# EAGLE board front-panel-test (EAGLE 5.11)
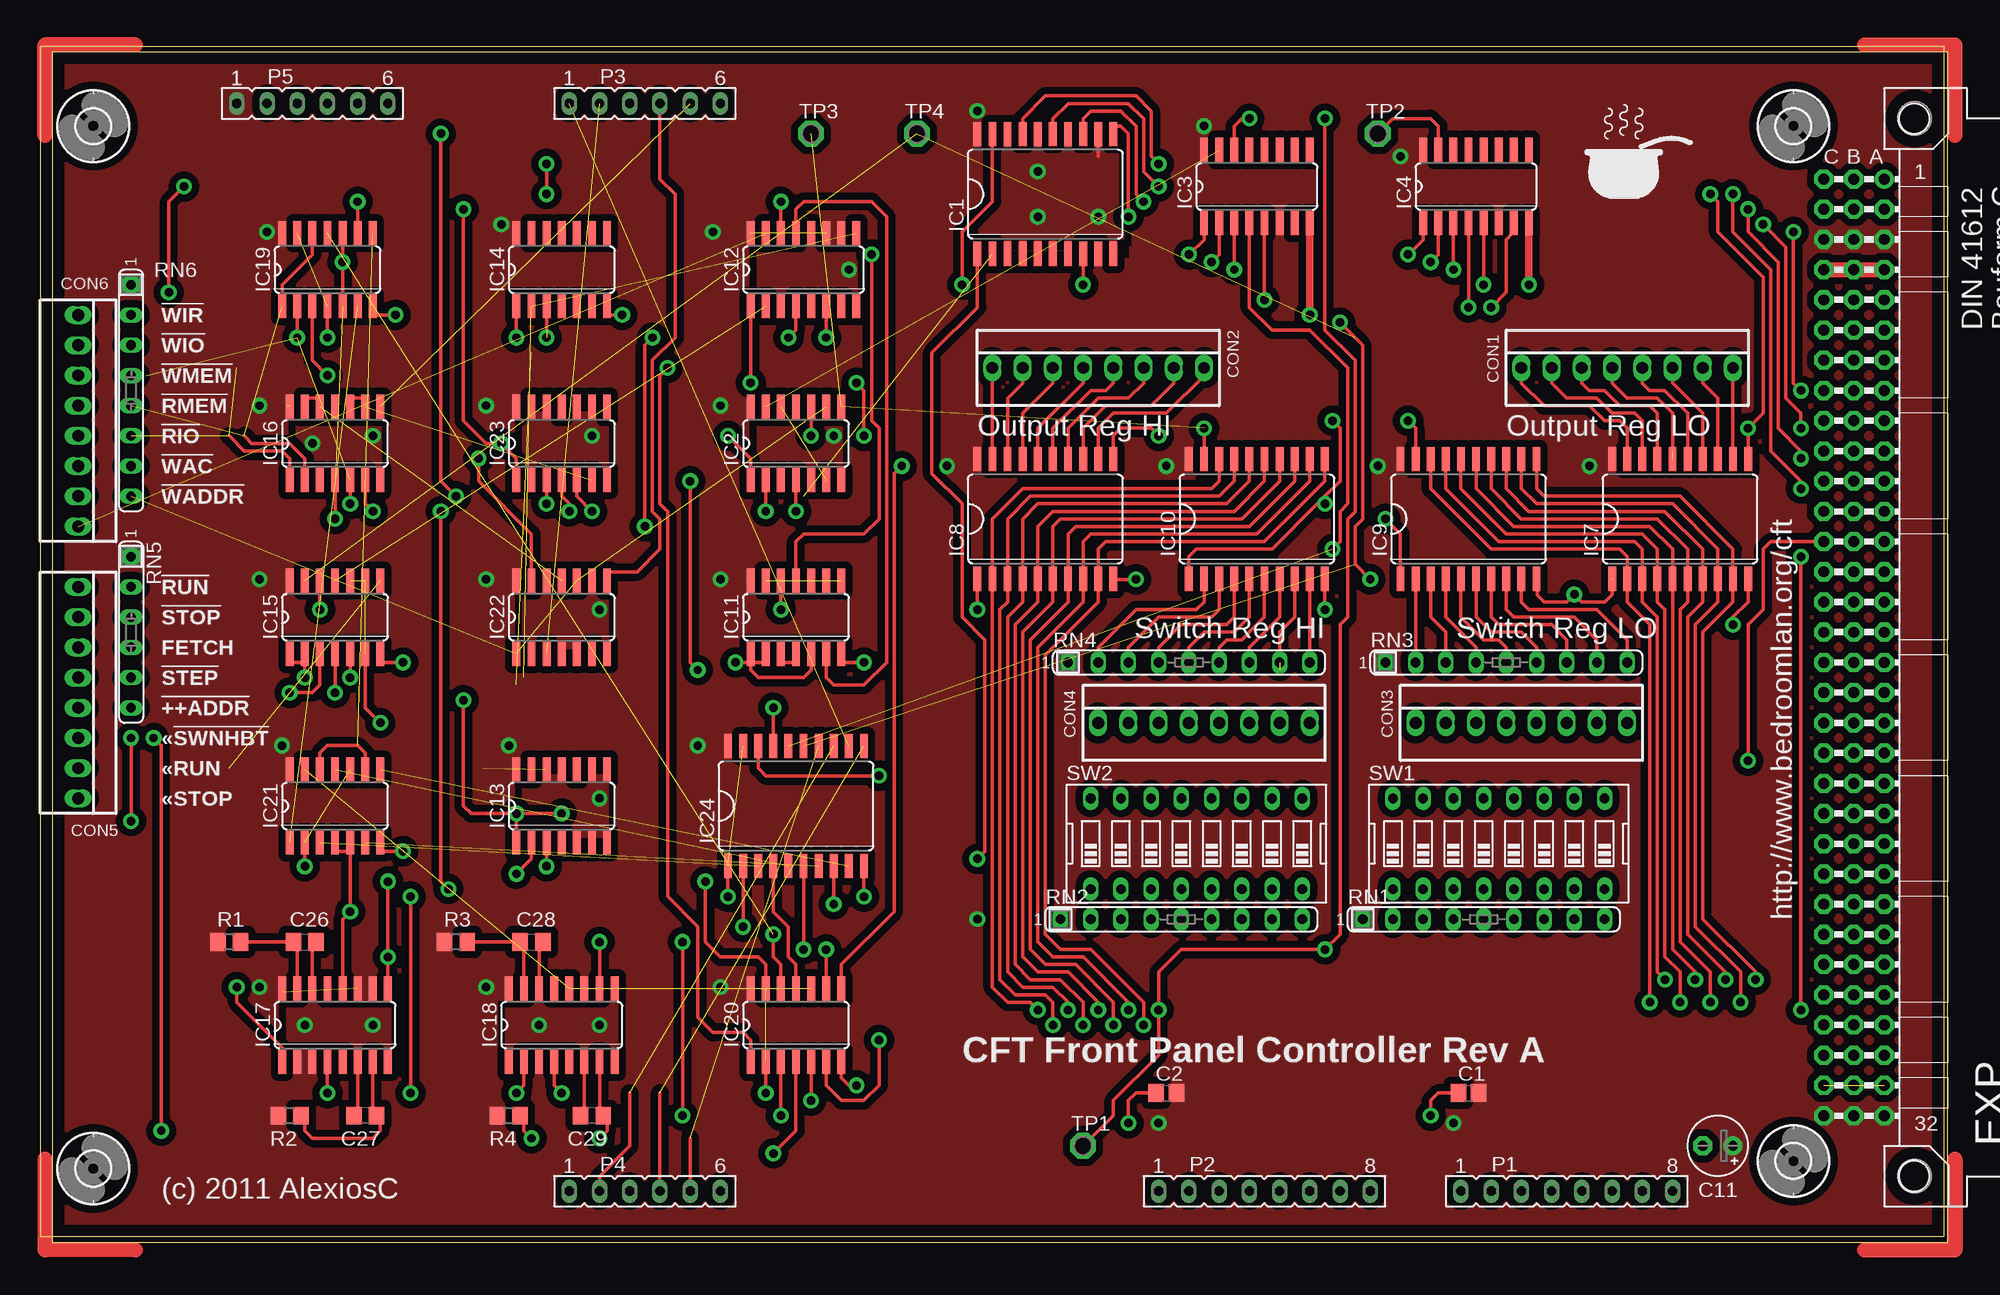
[diagram p4: board, top side]
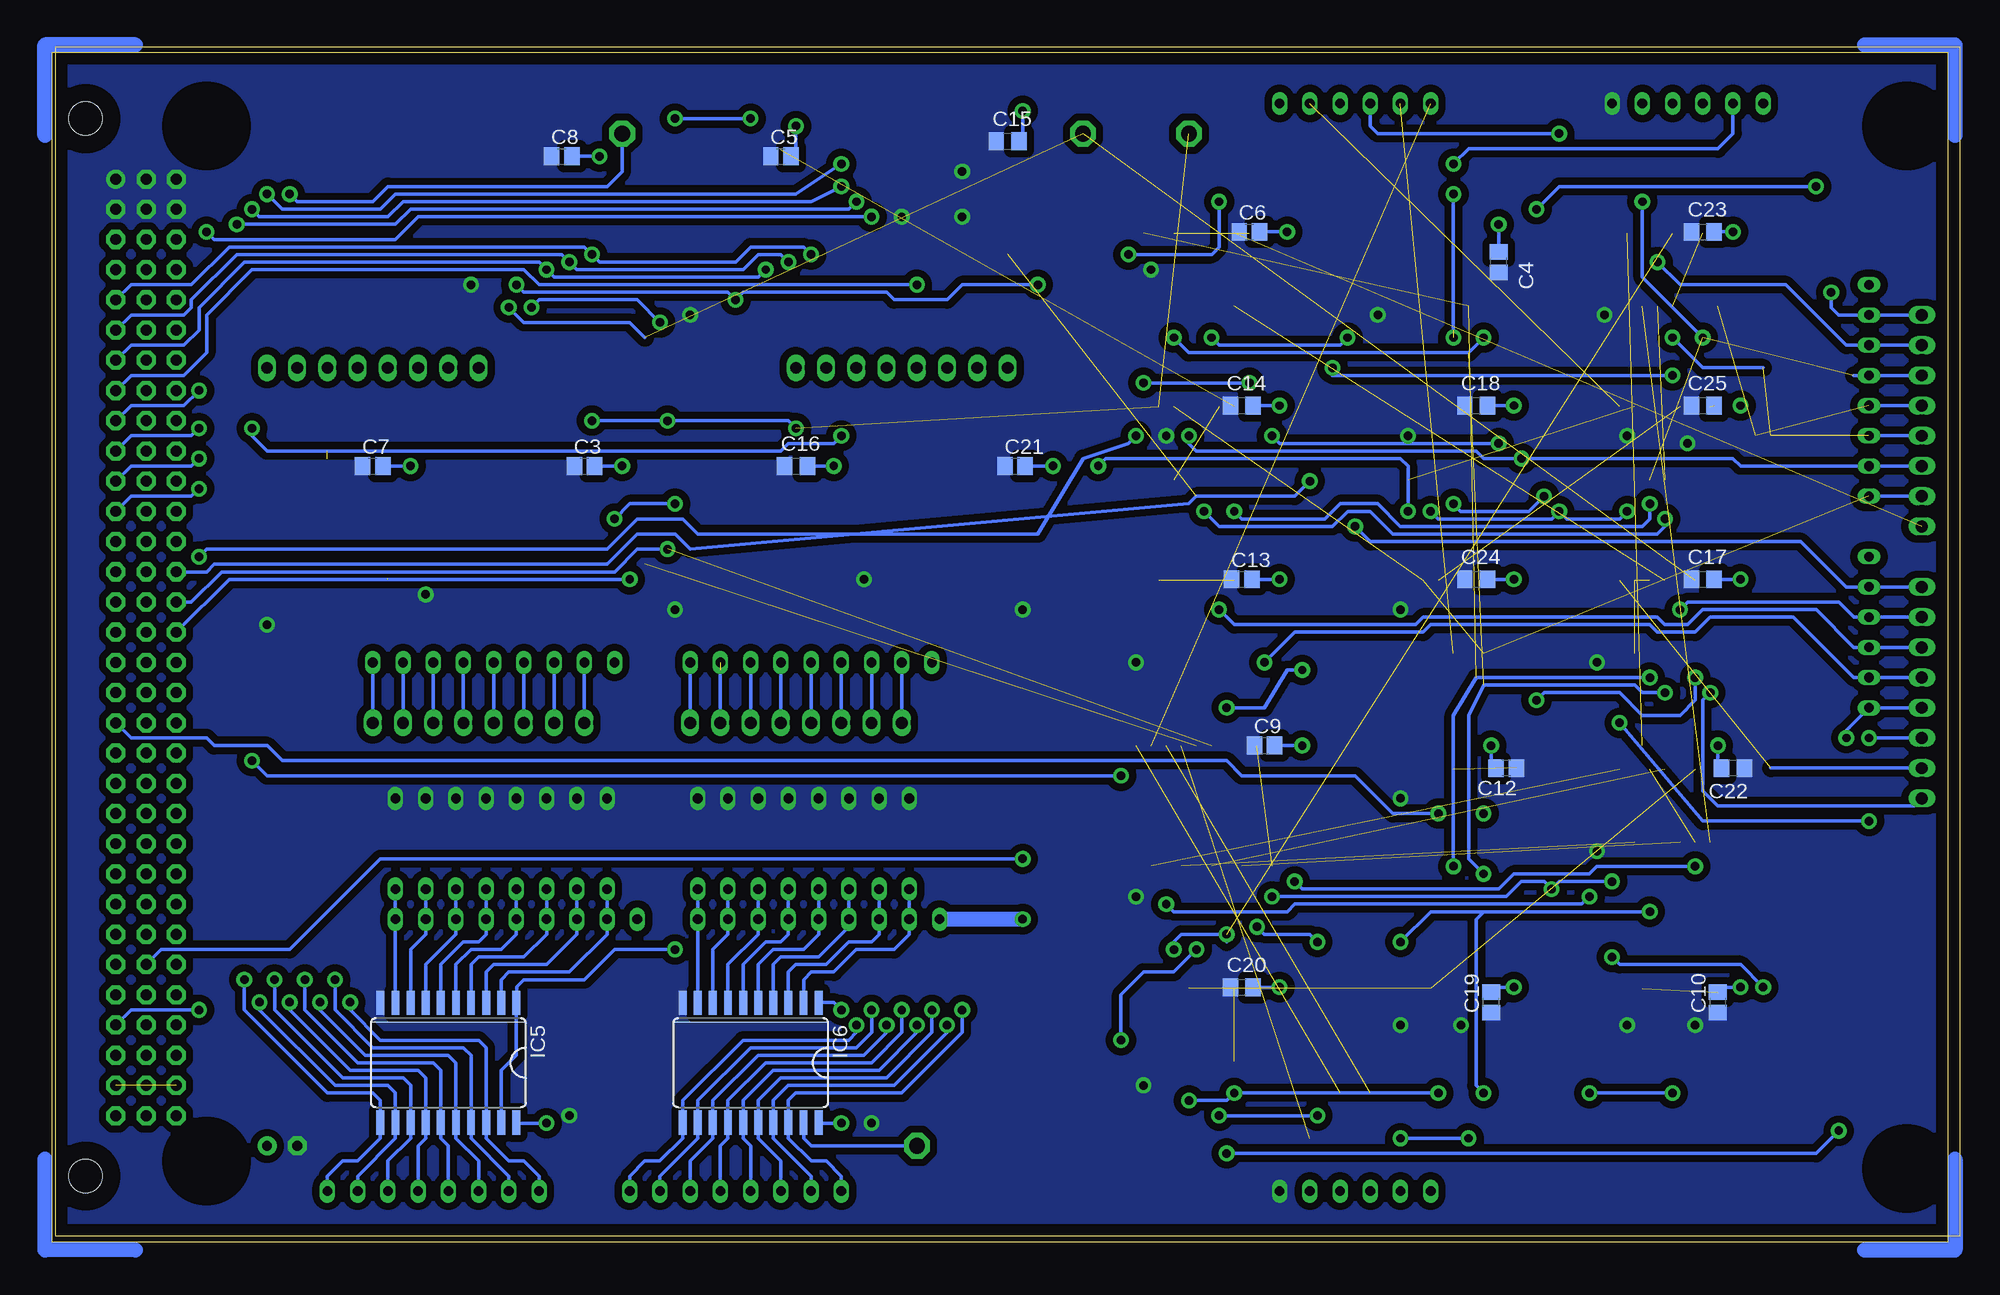
[diagram p5: board, bottom side, seen from below]

Size 160 x 100 mm. Coordinates in mm from the lower left corner, seen from the top.
Outline: 0,0 160,0 160,100 0,100 0,0
Copper layers (1*16): Top 0.035mm / dielectric 1.5mm / Bottom 0.035mm
Design rules "cft-olimex-10mil-small-pads-tented-vias": minimum track width 10mil, minimum drill 24mil, track to track 10mil, track to pad 10mil, pad to pad 10mil, via to via 10mil, smd to smd 10mil, copper to edge 40mil, drill to drill 10mil, minimum pad ring 10mil, minimum via ring 12mil, stop-mask expansion 4mil, vias tented up to drill 30mil, thermal gap 10mil
Net classes: 0 default: width 0.305 mm, clearance 0.254 mm; 1 Power: width 0.635 mm, clearance 0.254 mm; 2 12V: width 0.635 mm, clearance 0.635 mm

## Footprints (pad centres in the part's own frame; a part is rotated, then mirrored left to right if it is on the bottom)
C0805 = smd 1.3 x 1.5: 1 -0.85,0; 2 0.85,0
E2,5-5 = drill 0.813 pad 1.6 round: + -1.27,0 | drill 0.813 pad 1.6 octagon: - 1.27,0
C0805' = smd 1.3 x 1.5: 1 -0.95,0; 2 0.95,0
22-23-2081 = drill 1 long: 1 -8.89,0; 2 -6.35,0; 3 -3.81,0; 4 -1.27,0; 5 1.27,0; 6 3.81,0; 7 6.35,0; 8 8.89,0
VG96K = drill 0.914 pad 1.6 round: A1 154.94,39.37 | drill 0.914 pad 1.6 octagon: A2 154.94,36.83; A3 154.94,34.29; A4 154.94,31.75; A5 154.94,29.21; A6 154.94,26.67; A7 154.94,24.13; A8 154.94,21.59; A9 154.94,19.05; A10 154.94,16.51; A11 154.94,13.97; A12 154.94,11.43; A13 154.94,8.89; A14 154.94,6.35; A15 154.94,3.81; A16 154.94,1.27; A17 154.94,-1.27; A18 154.94,-3.81; A19 154.94,-6.35; A20 154.94,-8.89; A21 154.94,-11.43; A22 154.94,-13.97; A23 154.94,-16.51; A24 154.94,-19.05; A25 154.94,-21.59; A26 154.94,-24.13; A27 154.94,-26.67; A28 154.94,-29.21; A29 154.94,-31.75; A30 154.94,-34.29; A31 154.94,-36.83; A32 154.94,-39.37; B1 152.4,39.37; B2 152.4,36.83; B3 152.4,34.29; B4 152.4,31.75; B5 152.4,29.21; B6 152.4,26.67; B7 152.4,24.13; B8 152.4,21.59; B9 152.4,19.05; B10 152.4,16.51; B11 152.4,13.97; B12 152.4,11.43; B13 152.4,8.89; B14 152.4,6.35; B15 152.4,3.81; B16 152.4,1.27; B17 152.4,-1.27; B18 152.4,-3.81; B19 152.4,-6.35; B20 152.4,-8.89; B21 152.4,-11.43; B22 152.4,-13.97; B23 152.4,-16.51; B24 152.4,-19.05; B25 152.4,-21.59; B26 152.4,-24.13; B27 152.4,-26.67; B28 152.4,-29.21; B29 152.4,-31.75; B30 152.4,-34.29; B31 152.4,-36.83; B32 152.4,-39.37; C1 149.86,39.37; C2 149.86,36.83; C3 149.86,34.29; C4 149.86,31.75; C5 149.86,29.21; C6 149.86,26.67; C7 149.86,24.13; C8 149.86,21.59; C9 149.86,19.05; C10 149.86,16.51; C11 149.86,13.97; C12 149.86,11.43; C13 149.86,8.89; C14 149.86,6.35; C15 149.86,3.81; C16 149.86,1.27; C17 149.86,-1.27; C18 149.86,-3.81; C19 149.86,-6.35; C20 149.86,-8.89; C21 149.86,-11.43; C22 149.86,-13.97; C23 149.86,-16.51; C24 149.86,-19.05; C25 149.86,-21.59; C26 149.86,-24.13; C27 149.86,-26.67; C28 149.86,-29.21; C29 149.86,-31.75; C30 149.86,-34.29; C31 149.86,-36.83; C32 149.86,-39.37 | hole 2.794: 157.48,44.45; 157.48,-44.45
SO20W = smd 0.66 x 2.032: 1 -5.715,-5.029; 2 -4.445,-5.029; 3 -3.175,-5.029; 4 -1.905,-5.029; 5 -0.635,-5.029; 6 0.635,-5.029; 7 1.905,-5.029; 8 3.175,-5.029; 9 4.445,-5.029; 10 5.715,-5.029; 11 5.715,5.029; 12 4.445,5.029; 13 3.175,5.029; 14 1.905,5.029; 15 0.635,5.029; 16 -0.635,5.029; 17 -1.905,5.029; 18 -3.175,5.029; 19 -4.445,5.029; 20 -5.715,5.029
SO14 = smd 0.66 x 2.032: 1 -3.81,-3.073; 2 -2.54,-3.073; 3 -1.27,-3.073; 4 0,-3.073; 5 1.27,-3.073; 6 2.54,-3.073; 7 3.81,-3.073; 8 3.81,3.073; 9 2.54,3.073; 10 1.27,3.073; 11 0,3.073; 12 -1.27,3.073; 13 -2.54,3.073; 14 -3.81,3.073
SO16 = smd 0.66 x 2.032: 1 -4.445,-3.073; 2 -3.175,-3.073; 3 -1.905,-3.073; 4 -0.635,-3.073; 5 0.635,-3.073; 6 1.905,-3.073; 7 3.175,-3.073; 8 4.445,-3.073; 9 4.445,3.073; 10 3.175,3.073; 11 1.905,3.073; 12 0.635,3.073; 13 -0.635,3.073; 14 -1.905,3.073; 15 -3.175,3.073; 16 -4.445,3.073
FE08 = drill 0.813 long: 1 -8.89,0; 2 -6.35,0; 3 -3.81,0; 4 -1.27,0; 5 1.27,0; 6 3.81,0; 7 6.35,0; 8 8.89,0
FE06 = drill 0.813 long: 1 -6.35,0; 2 -3.81,0; 3 -1.27,0; 4 1.27,0; 5 3.81,0; 6 6.35,0
R0805 = smd 1.3 x 1.5: 1 -0.95,0; 2 0.95,0
SIL9 = drill 0.813 long: 1 -10.16,0; 2 -7.62,0; 3 -5.08,0; 4 -2.54,0; 5 0,0; 6 2.54,0; 7 5.08,0; 8 7.62,0; 9 10.16,0
SIL6 = drill 0.813 long: 1 -6.35,0; 2 -3.81,0; 3 -1.27,0; 4 1.27,0; 5 3.81,0; 6 6.35,0
SIL8 = drill 0.813 long: 1 -8.89,0; 2 -6.35,0; 3 -3.81,0; 4 -1.27,0; 5 1.27,0; 6 3.81,0; 7 6.35,0; 8 8.89,0
EDG-08 = drill 0.813 long: 1 -8.89,-3.81; 2 -6.35,-3.81; 3 -3.81,-3.81; 4 -1.27,-3.81; 5 1.27,-3.81; 6 3.81,-3.81; 7 6.35,-3.81; 8 8.89,-3.81; 9 8.89,3.81; 10 6.35,3.81; 11 3.81,3.81; 12 1.27,3.81; 13 -1.27,3.81; 14 -3.81,3.81; 15 -6.35,3.81; 16 -8.89,3.81
P1-13 = drill 1.321 pad 2.159 octagon: TP 0,0

## Placement (x,y rotation side)
C1  100nF  [C0805]  120.02,12.06 0 top
C2  100nF  [C0805]  94.61,12.06 0 top
C3  100nF  [C0805]  115.57,64.77 0 bottom
C4  100nF  [C0805]  38.73,81.92 90 bottom
C5  100nF  [C0805]  99.06,90.81 0 bottom
C6  100nF  [C0805]  59.69,84.45 0 bottom
C7  100nF  [C0805]  133.35,64.77 0 bottom
C8  100nF  [C0805]  117.47,90.81 0 bottom
C9  100nF  [C0805]  58.42,41.27 0 bottom
C10  100nF  [C0805]  20.32,19.68 90 bottom
C11  1uF  [E2,5-5]  140.97,7.62 180 top
C12  100nF  [C0805]  38.1,39.37 180 bottom
C13  100nF  [C0805]  60.33,55.24 0 bottom
C14  100nF  [C0805']  60.33,69.85 0 bottom
C15  100nF  [C0805']  80.01,92.08 0 bottom
C16  100nF  [C0805']  97.79,64.77 0 bottom
C17  100nF  [C0805']  21.59,55.24 0 bottom
C18  100nF  [C0805']  40.64,69.85 0 bottom
C19  100nF  [C0805]  39.37,19.68 90 bottom
C20  100nF  [C0805']  60.33,20.95 0 bottom
C21  100nF  [C0805]  79.38,64.77 0 bottom
C22  100nF  [C0805']  19.05,39.37 180 bottom
C23  100nF  [C0805']  21.59,84.45 0 bottom
C24  100nF  [C0805']  40.64,55.24 0 bottom
C25  100nF  [C0805']  21.59,69.85 0 bottom
C26  [C0805']  22.23,24.77 0 top
C27  [C0805']  27.3,10.16 180 top
C28  [C0805']  41.27,24.77 0 top
C29  [C0805']  46.35,10.16 180 top
CON1  [22-23-2081]  133.35,73.03 0 top
CON2  [22-23-2081]  88.9,73.03 0 top
CON3  [22-23-2081]  124.46,43.18 0 top
CON4  [22-23-2081]  97.79,43.18 0 top
CON5  22-23-2081  [22-23-2081]  3.17,45.72 270 top
CON6  22-23-2081  [22-23-2081]  3.17,68.58 270 top
EXP  [VG96K]  0,49.53 0 top
H1  HOLE  [STANDOFF_28_60]  147.32,93.34 0 top
H2  HOLE  [STANDOFF_28_60]  147.32,6.35 0 top
H3  HOLE  [STANDOFF_28_60]  4.45,5.71 0 top
H4  HOLE  [STANDOFF_28_60]  4.45,93.34 0 top
IC1  74HC688DW  [SO20W]  84.45,87.63 0 top
IC2  74HC21D  [SO14]  63.5,66.67 0 top
IC3  74HC138D  [SO16]  102.23,88.27 0 top
IC4  74HC138D  [SO16]  120.65,88.27 0 top
IC5  74HC541DW  [SO20W]  127,14.61 180 bottom
IC6  74HC541DW  [SO20W]  101.6,14.61 180 bottom
IC7  74HCT574D  [SO20W]  137.79,60.33 0 top
IC8  74HCT574D  [SO20W]  84.45,60.33 0 top
IC9  74HC541DW  [SO20W]  120.02,60.33 0 top
IC10  74HC541DW  [SO20W]  102.23,60.33 0 top
IC11  74HC00D  [SO14]  63.5,52.07 0 top
IC12  74HC112D  [SO16]  64.14,81.28 0 top
IC13  74HC01D  [SO14]  43.81,36.2 0 top
IC14  74HC00D  [SO14]  43.81,81.28 0 top
IC15  74HC00D  [SO14]  24.77,52.07 0 top
IC16  74HC21D  [SO14]  24.77,66.67 0 top
IC17  74LS123D  [SO16]  24.77,17.78 0 top
IC18  74LS123D  [SO16]  43.81,17.78 0 top
IC19  74HC08D  [SO14]  24.13,81.28 0 top
IC20  74HCT32D  [SO14]  63.5,17.78 0 top
IC21  74HCT32D  [SO14]  24.77,36.2 0 top
IC22  74HC125D  [SO14]  43.81,52.07 0 top
IC23  74HC125D  [SO14]  43.81,66.67 0 top
IC24  74HC541DW  [SO20W]  63.5,36.2 0 top
P1  [FE08]  128.27,3.81 0 top
P2  [FE08]  102.87,3.81 0 top
P3  [FE06]  50.8,95.25 0 top
P4  [FE06]  50.8,3.81 0 top
P5  [FE06]  22.86,95.25 0 top
R1  [R0805]  15.88,24.77 180 top
R2  [R0805]  20.95,10.16 180 top
R3  [R0805]  34.92,24.77 180 top
R4  [R0805]  39.37,10.16 180 top
RN1  2k2  [SIL9]  121.28,26.67 0 top
RN2  2k2  [SIL9]  95.89,26.67 0 top
RN3  2k2  [SIL9]  123.19,48.26 0 top
RN4  2k2  [SIL9]  96.52,48.26 0 top
RN5  2k2  [SIL6]  7.62,50.8 270 top
RN6  2k2  [SIL8]  7.62,71.12 270 top
SW1  [EDG-08]  122.56,33.02 0 top
SW2  [EDG-08]  97.16,33.02 0 top
TP1  TPPAD1-13  [P1-13]  87.63,7.62 0 top
TP2  TPPAD1-13  [P1-13]  112.39,92.71 0 top
TP3  TPPAD1-13  [P1-13]  64.77,92.71 0 top
TP4  TPPAD1-13  [P1-13]  73.66,92.71 0 top
U$1  SIGNATURESILK  [SIGNATURE]  130.18,87 0 top

## Tracks (layer width: path | path; a pad name or v marks a point on that pad's centre or on a via)
!CLKOREG  (via drill 0.71)
  Top 0.305: v140.34,87.63 140.97,87 140.97,84.45 144.78,80.64 144.78,69.22 v143.51,67.94 IC7.11 | IC8.11 90.17,67.31 90.81,67.94 93.34,67.94 v93.98,67.31 | IC4.15 117.47,93.34 116.84,93.98 113.67,93.98 TP2.TP
  Bottom 0.305: v140.34,87.63 139.7,87 133.35,87 132.08,88.27 113.67,88.27 112.39,89.53 TP2.TP | v93.98,67.31 94.61,66.67 98.42,66.67 99.06,66.04 142.24,66.04 143.51,67.31 v143.51,67.94
!FPINCADDR  (via drill 0.71)
  Top 0.305: v9.53,41.91 10.16,41.27 v10.16,8.89 | IC20.4 63.5,8.89 v61.59,6.99
  Bottom 0.305: CON5.5 RN5.6 9.53,42.55 v9.53,41.91 | v61.59,6.99 12.06,6.99 v10.16,8.89
!FPIO  (1 unrouted)
!FPMEM  (via drill 0.71)
  Top 0.305: IC19.3 22.86,73.66 v24.13,72.39 | v52.7,73.03 52.07,72.39 52.07,61.59 52.7,60.96 52.7,28.57 55.24,26.04 55.24,18.41 56.52,17.14 59.05,17.14 59.69,16.51 IC20.1
  Bottom 0.305: v24.13,72.39 52.7,72.39 v52.7,73.03
!FPR  (via drill 0.71)  (1 unrouted)
  Top 0.305: v66.04,24.13 IC20.9 | IC20.12 62.23,22.86 61.59,23.5 v61.59,25.4
  Bottom 0.305: v61.59,25.4 61.59,24.77 62.23,25.4 65.41,25.4 66.04,24.77 v66.04,24.13
!FPRIO  (via drill 0.71)  (3 unrouted)
  Top 0.305: v24.13,75.56 IC19.4 | 15.88,67.31 17.14,66.04 20.32,66.04 20.95,65.41 IC16.1
  Bottom 0.305: CON6.5 RN6.6 | v24.13,75.56 21.59,73.03 16.51,73.03
!FPRMEM  (2 unrouted)
  Top 0.305: IC19.1 20.32,80.01 22.86,82.55 IC19.12 | IC16.2 22.23,65.41 20.95,66.67 17.78,66.67 17.14,67.31
  Bottom 0.305: CON6.4 RN6.5
!FPRUN  (via drill 0.71)
  Top 0.305: v50.8,59.69 50.8,74.93 v51.44,75.56 | v62.87,75.56 63.5,76.2 IC12.4
  Bottom 0.305: CON5.1 RN5.2 9.53,54.61 13.34,58.42 49.53,58.42 v50.8,59.69 | v51.44,75.56 52.07,74.93 62.23,74.93 v62.87,75.56
!FPSTEP  (via drill 0.71)
  Top 0.305: v58.42,48.26 59.69,48.26 | 59.69,48.26 IC11.1 | 59.69,48.26 60.96,48.26 IC11.2 | IC11.5 64.77,47.62 64.14,46.99 60.33,46.99 59.69,47.62 59.69,48.26
  Bottom 0.305: CON5.4 RN5.5 8.89,46.99 13.97,52.07 20.95,52.07 22.23,50.8 25.4,50.8 26.04,51.44 44.45,51.44 45.09,50.8 55.88,50.8 v58.42,48.26
!FPSTOP  (via drill 0.71)
  Top 0.305: v23.5,52.7 IC15.12
  Bottom 0.305: CON5.2 RN5.3 8.89,52.07 10.16,53.34 22.86,53.34 v23.5,52.7
!FPW  (1 unrouted)
  Top 0.305: IC21.12 23.5,40.64 24.13,41.27 26.67,41.27 27.3,40.64 IC21.9
!FPWAC  (via drill 0.71)
  Top 0.305: v64.77,67.31 IC2.10 | IC22.13 41.27,59.05 36.83,63.5 v36.83,65.41
  Bottom 0.305: CON6.6 RN6.7 18.41,64.77 19.05,65.41 v36.83,65.41 40.01,65.41 40.64,66.04 64.14,66.04 64.77,66.67 v64.77,67.31
!FPWADDR  (3 unrouted)
  Bottom 0.305: CON6.7 RN6.8
!FPWIO  (via drill 0.71)  (1 unrouted)
  Top 0.305: IC19.10 v25.4,81.92 IC19.5 | v24.77,60.33 IC16.4 | v63.5,60.96 IC2.4
  Bottom 0.305: CON6.2 RN6.3 9.53,74.93 14.61,80.01 23.5,80.01 v25.4,81.92 | v24.77,60.33 24.77,59.69 25.4,59.05 47.62,59.05 49.53,60.96 51.44,60.96 52.7,59.69 62.23,59.69 v63.5,60.96
!FPWIR  (via drill 0.71)
  Top 0.305: v35.56,86.36 35.56,68.58 37.47,66.67 v38.73,66.67 40.01,65.41 IC23.1 | IC2.1 59.69,65.41 v57.78,67.31 | v10.79,79.38 10.79,87 v12.06,88.27
  Bottom 0.305: CON6.1 RN6.2 10.16,77.47 10.79,78.11 v10.79,79.38 | v35.56,86.36 33.66,88.27 v12.06,88.27 | v57.78,67.31 57.15,66.67 v38.73,66.67
!FPWMEM  (via drill 0.71)  (2 unrouted)
  Top 0.305: v21.59,75.56 IC19.2 | v26.67,87 IC19.9 | v26.04,61.59 IC16.5 | v60.96,60.96 IC2.2
  Bottom 0.305: CON6.3 RN6.4 8.89,72.39 | v21.59,75.56 26.67,80.64 v26.67,87 | v26.04,61.59 26.04,60.33 26.67,59.69 46.99,59.69 48.9,61.59 52.07,61.59 53.34,60.33 60.33,60.33 v60.96,60.96
!HALT  (via drill 0.71)
  Top 0.305: IC15.1 20.95,48.26 22.23,48.26 IC15.2 v22.23,46.99 | 40.01,32.38 IC13.1 v40.01,35.56 | v35.56,45.09 35.56,36.2 36.2,35.56 v40.01,35.56 | v40.01,35.56 v43.81,35.56
  Bottom 0.305: v22.23,46.99 22.23,45.09 23.5,43.81 26.67,43.81 28.57,45.72 34.92,45.72 v35.56,45.09 | EXP.A19 153.67,41.91 147.32,41.91 146.69,41.27 142.24,41.27 140.97,40.01 61.59,40.01 60.33,38.73 50.8,38.73 47.62,35.56 v43.81,35.56
!HALTINSTR  (via drill 0.71)  (2 unrouted)
  Top 0.305: IC4.7 123.83,84.45 123.19,83.82 123.19,79.38 v121.92,78.11
  Bottom 0.305: v121.92,78.11 120.65,76.83 111.76,76.83 110.49,75.56
!INCPC  (1 unrouted)
  Top 0.305: P4.5 54.61,8.26
!IO  (via drill 0.71)  (1 unrouted)
  Top 0.305: v54.61,63.5 54.61,48.26 v55.24,47.62 | v61.59,44.45 IC24.17
  Bottom 0.305: EXP.C14 147.32,55.88 146.69,56.52 113.67,56.52 111.12,59.05 107.95,59.05 106.68,57.78 64.77,61.59 64.14,62.23 55.88,62.23 v54.61,63.5 | v55.24,47.62 56.52,47.62 58.42,44.45 v61.59,44.45
!MC0  (via drill 0.71)
  Top 0.305: v24.13,12.06 IC17.4 | v31.11,12.06 v31.11,28.57 | v66.67,27.94 IC24.8
  Bottom 0.305: v24.13,12.06 v31.11,12.06 | v31.11,28.57 31.75,27.94 55.88,27.94 56.52,27.3 66.04,27.3 v66.67,27.94
!MC1  (via drill 0.71)
  Top 0.305: 26.04,32.38 IC21.5 | IC21.4 24.77,32.38 26.04,32.38 | IC17.12 25.4,26.67 v26.04,27.3 26.04,32.38 | v46.99,24.77 IC18.10 | v40.01,12.06 40.64,12.7 IC18.2
  Bottom 0.305: v26.04,27.3 40.01,27.3 | 40.01,27.3 44.45,27.3 v46.99,24.77 | v40.01,12.06 40.64,12.7 40.64,26.67 40.01,27.3
!MC2  (via drill 0.71)  (2 unrouted)
  Top 0.305: v64.77,11.43 IC20.5 | v60.96,12.06 IC20.2 | v43.81,12.06 43.18,12.7 IC18.4 | v22.23,31.11 IC21.2 | v55.88,29.84 55.88,24.77 57.15,23.5 60.33,23.5 60.96,22.86 IC20.13
  Bottom 0.305: v64.77,11.43 61.59,11.43 v60.96,12.06 v43.81,12.06 | v22.23,31.11 30.48,31.11 31.11,30.48 37.47,30.48 38.73,29.21 55.24,29.21 v55.88,29.84
!MC3  (2 unrouted)
!MCSTART  (via drill 0.71)  (1 unrouted)
  Top 0.305: v57.78,28.57 IC24.1 | IC17.9 v29.21,23.5 v29.21,29.84 | 20.32,13.97 IC17.1 20.32,15.88 16.51,19.68 v16.51,20.95 | IC16.6 27.3,61.59 v27.94,60.96 | v44.45,60.96 44.45,61.59 43.81,62.23 IC23.4 | v33.66,60.96 33.66,29.84 v34.29,29.21
  Bottom 0.305: v29.21,29.84 33.66,29.84 v34.29,29.21 34.92,29.84 36.83,29.84 38.1,28.57 v57.78,28.57 | v16.51,20.95 18.41,22.86 28.57,22.86 v29.21,23.5 | v27.94,60.96 28.57,60.33 33.02,60.33 v33.66,60.96 34.29,60.33 43.81,60.33 v44.45,60.96
!MCWAC  (1 unrouted)
  Top 0.305: IC16.10 26.04,70.48 27.3,70.48 IC16.9
!MEM  (via drill 0.71)
  Top 0.305: IC24.18 60.33,39.37 60.96,38.73 v70.48,38.73 | v143.51,40.01 143.51,51.44 144.78,52.7 144.78,57.78 145.41,58.42 EXP.C13
  Bottom 0.305: v70.48,38.73 142.24,38.73 v143.51,40.01
!R  (via drill 0.71)  (1 unrouted)
  Top 0.305: IC3.4 101.6,78.11 103.5,76.2 106.68,76.2 109.86,73.03 109.86,61.59 109.22,60.96 109.22,58.42 v108.58,57.78
  Bottom 0.305: EXP.C15 148.59,53.34 146.05,55.88 113.03,55.88 111.12,57.78 v108.58,57.78
!RAC  (1 unrouted)
  Top 0.305: P4.4 52.07,12.06
!RDPSW  (via drill 0.71)
  Top 0.305: v101.6,93.98 100.97,93.98 100.33,93.34 IC3.14 | v107.95,93.98 107.95,76.2 110.49,73.66 110.49,60.96 109.86,60.33 109.86,52.07 109.22,51.44 109.22,25.4 v107.95,24.13 95.89,24.13 93.98,22.23 v93.98,19.05 93.98,15.24 90.17,11.43 90.17,10.16 TP1.TP
  Bottom 0.305: IC5.19 122.56,13.97 121.28,15.24 IC5.1 121.23,19.68 121.23,21.01 120.65,21.59 115.57,21.59 113.03,24.13 v107.95,24.13 | IC6.1 95.83,19.68 94.61,19.68 v93.98,19.05 | IC6.19 97.16,8.26 96.52,7.62 TP1.TP | v107.95,93.98 v101.6,93.98
!RPC  (1 unrouted)
  Top 0.305: P4.2 46.99,5.08 49.53,7.62 49.53,12.06
!RSW  (via drill 0.71)  (2 unrouted)
  Top 0.305: IC10.1 96.52,57.15 97.16,57.78 103.5,57.78 107.31,61.59 v107.95,61.59 107.95,62.23 109.22,63.5 109.22,67.94 v108.58,68.58 | IC9.1 114.3,59.05 v113.03,60.33 | v97.79,67.94 IC10.19 | IC9.19 115.57,67.94 v114.94,68.58
  Bottom 0.305: v97.79,67.94 98.42,68.58 v108.58,68.58 v114.94,68.58 | v107.95,61.59 111.76,61.59 v113.03,60.33
!SWINHIBIT  (via drill 0.71)  (2 unrouted)
  Top 0.305: IC15.6 27.3,44.45 v28.57,43.18 | v7.62,34.92 v7.62,41.91
  Bottom 0.305: v28.57,43.18 21.59,34.92 v7.62,34.92 | v7.62,41.91 CON5.6
!SYSDEV  (via drill 0.71)
  Top 0.305: v78.74,31.75 79.38,32.38 79.38,50.16 77.47,52.07 77.47,61.59 74.93,64.14 74.93,74.3 78.74,78.11 IC1.1
  Bottom 0.305: EXP.B27 151.13,24.13 140.34,24.13 132.72,31.75 v78.74,31.75
!W  (via drill 0.71)  (1 unrouted)
  Top 0.305: v120.02,78.11 IC4.4 | v111.76,55.24 110.49,56.52 110.49,59.69 111.12,60.33 111.12,74.93 v109.22,76.83
  Bottom 0.305: EXP.C16 145.41,55.24 v111.76,55.24 | v109.22,76.83 111.12,78.74 119.38,78.74 v120.02,78.11
!WAC  (1 unrouted)
!WAR  (1 unrouted)
!WDR
  Top 0.305: IC22.8 47.62,55.88 50.16,55.88 52.07,57.78 52.07,60.33 51.44,60.96 51.44,73.66 53.34,75.56 53.34,87.63 52.07,88.9 P3.4
!WIR  (via drill 0.71)
  Top 0.305: v33.66,92.71 33.66,63.5 v34.92,62.23 | v42.55,61.59 IC23.3
  Bottom 0.305: P3.3 49.53,93.34 48.9,92.71 v33.66,92.71 | v34.92,62.23 36.2,60.96 41.91,60.96 v42.55,61.59
!WPC  (1 unrouted)
+3.3V
  Top 1.27: EXP.C4 EXP.B4 EXP.A4
+12V  (2 unrouted)
AB0  (via drill 0.71)
  Top 0.305: v96.52,82.55 97.79,83.82 IC3.1 | IC4.1 116.2,83.82 v114.94,82.55
  Bottom 0.305: EXP.A5 153.67,80.01 148.59,80.01 145.41,83.19 115.57,83.19 v114.94,82.55 114.3,81.92 102.87,81.92 101.6,83.19 97.16,83.19 v96.52,82.55
AB1  (via drill 0.71)
  Top 0.305: v116.84,81.92 117.47,82.55 IC4.2 | v98.42,81.92 99.06,82.55 IC3.2
  Bottom 0.305: EXP.A6 153.67,77.47 149.22,77.47 148.59,78.11 148.59,78.74 144.78,82.55 117.47,82.55 v116.84,81.92 116.2,81.28 102.23,81.28 100.97,82.55 99.06,82.55 v98.42,81.92
AB2  (via drill 0.71)
  Top 0.305: v118.75,81.28 IC4.3 | v100.33,81.28 IC3.3
  Bottom 0.305: EXP.A7 153.67,74.93 149.22,74.93 147.96,76.2 147.96,78.11 144.15,81.92 119.38,81.92 v118.75,81.28 118.11,80.64 100.97,80.64 v100.33,81.28
AB3  (via drill 0.71)
  Top 0.305: v87.63,80.01 IC1.8
  Bottom 0.305: EXP.A8 153.67,72.39 149.22,72.39 147.32,74.3 147.32,77.47 143.51,81.28 120.65,81.28 119.38,80.01 v87.63,80.01
AB4  (via drill 0.71)
  Top 0.305: 90.17,92.71 IC1.11 90.17,93.34 90.81,93.34 91.44,92.71 v91.44,85.72 | v147.96,71.12 147.32,71.75 v147.32,84.45
  Bottom 0.305: EXP.A9 153.67,69.85 149.22,69.85 v147.96,71.12 | v147.32,84.45 146.69,83.82 131.44,83.82 129.54,85.72 v91.44,85.72
AB5  (via drill 0.71)
  Top 0.305: IC1.13 87.63,93.98 88.27,94.61 90.81,94.61 92.08,93.34 92.08,87.63 v92.71,87 | v147.96,67.94 147.96,69.22 146.69,70.48 146.69,83.19 v144.78,85.09
  Bottom 0.305: EXP.A10 153.67,67.31 148.59,67.31 v147.96,67.94 | v144.78,85.09 131.44,85.09 130.18,86.36 93.34,86.36 v92.71,87
AB6  (via drill 0.71)
  Top 0.305: IC1.15 85.09,93.98 86.36,95.25 91.44,95.25 92.71,93.98 92.71,89.53 v93.98,88.27 | v147.96,65.41 147.96,66.04 146.05,67.94 146.05,81.92 143.51,84.45 v143.51,86.36
  Bottom 0.305: EXP.A11 153.67,64.77 148.59,64.77 v147.96,65.41 | v143.51,86.36 142.88,85.72 132.08,85.72 130.81,87 96.52,87 v93.98,88.27
AB7  (via drill 0.71)
  Top 0.305: IC1.17 82.55,93.98 84.45,95.89 92.08,95.89 93.34,94.61 93.34,90.81 v93.98,90.17 | v147.96,62.87 147.96,63.5 145.41,66.04 145.41,81.28 142.24,84.45 v142.24,87.63
  Bottom 0.305: EXP.A12 153.67,62.23 148.59,62.23 v147.96,62.87 | v142.24,87.63 140.97,86.36 132.72,86.36 131.44,87.63 97.79,87.63 v93.98,90.17
CLK1  (via drill 0.71)
  Top 0.305: v147.96,57.15 v147.96,19.05 | v69.22,67.31 69.22,71.12 v68.58,71.75 | v59.69,71.75 IC12.1
  Bottom 0.305: EXP.A29 153.67,19.05 v147.96,19.05 | v147.96,57.15 147.32,57.78 113.67,57.78 111.12,60.33 107.31,60.33 106.05,59.05 77.47,59.05 73.66,65.41 69.85,66.67 v69.22,67.31 | v59.69,71.75 v68.58,71.75
CLKEN  (via drill 0.71)  (1 unrouted)
  Top 0.305: v42.55,75.56 IC14.3 | v42.55,90.17 v42.55,87.63
  Bottom 0.305: P5.2 19.05,92.71 20.32,91.44 41.27,91.44 v42.55,90.17 | v42.55,87.63 42.55,76.2
FETCH  (via drill 0.71)  (2 unrouted)
  Top 0.305: v62.23,52.7 IC11.12
  Bottom 0.305: CON5.3 RN5.4 8.89,49.53 12.06,52.7 21.59,52.7 22.86,51.44 24.77,51.44 25.4,52.07 45.09,52.07 45.72,51.44 60.96,51.44 v62.23,52.7
GND  (via drill 0.71)  (2 unrouted)
  Top 0.305: 132.03,55.24 IC7.1 | IC9.10 125.78,55.24 125.78,53.92 126.36,53.34 128.27,53.34 v128.91,53.98 129.54,53.34 131.44,53.34 132.08,53.98 132.08,55.24 | v142.24,51.44 142.24,52.07 143.51,53.34 IC7.10 | IC8.10 90.22,55.24 v92.08,55.24 | IC10.10 108,55.24 107.95,55.19 v107.95,52.7 | IC8.1 arc-90 78.69,55.24 78.74,55.19 v78.74,52.7 | C2.1 92.08,12.06 91.44,11.43 v91.44,9.53 | C1.1 117.47,12.06 116.84,11.43 v116.84,10.16 | IC1.3 81.28,81.92 | IC1.4 82.55,81.92 | IC1.5 83.82,81.92 | IC1.6 85.09,81.92 | IC1.7 86.36,81.92 | IC1.10 90.17,81.92 | 88.9,90.81 IC1.12 | C26.2 22.86,24.45 IC17.14 | IC17.6 26.67,10.47 C27.2 | C28.2 41.91,24.45 IC18.14 | IC18.6 45.72,10.47 C29.2 | IC19.7 27.94,77.47 v29.84,77.47 | IC14.7 47.62,77.47 v48.9,77.47 | IC12.8 68.58,77.47 | IC22.7 47.62,48.26 | 67.31,62.87 IC2.7 | IC11.7 67.31,48.26 v69.22,48.26 | 47.62,32.38 IC13.7 | IC15.7 28.57,48.26 v30.48,48.26 | IC21.7 28.68,33.02 28.57,32.92 28.57,32.38 v30.48,32.38 | v69.22,28.57 IC24.10 | IC20.7 67.31,13.34 67.94,12.7 v68.58,12.7
  Top 0.61: 106.68,85.09 IC3.8 v106.68,77.47 | v125.09,80.01 IC4.8
  other vias: 88.9,85.72 83.82,85.72 83.82,89.53 41.91,17.78 46.99,17.78 22.23,17.78 27.94,17.78 67.94,81.28 46.99,52.7 66.67,67.31 27.94,67.31 46.99,36.83 46.35,67.31 22.86,66.67
  pour Bottom (isolate 0.61, rank 6, no thermals): 0,0 160.02,0 160.02,99.06 0,99.06
  pour Top (isolate 0.61, rank 5): 80.64,92.08 90.81,92.08 90.81,83.19 78.74,83.19 78.74,85.09 80.64,87
  pour Top (isolate 0.61, rank 5, no thermals): 39.37,15.24 48.26,15.24 48.26,20.32 39.37,20.32
  pour Top (isolate 0.61, no thermals): 20.95,15.24 20.95,20.32 29.21,20.32 29.21,15.24
  pour Top (isolate 0.61, rank 5, no thermals): 60.33,83.82 60.33,78.11 68.58,78.11 68.58,83.82
  pour Top (isolate 0.61, rank 5, no thermals): 40.64,69.22 40.64,64.14 47.62,64.14 47.62,69.22
  pour Top (isolate 0.61, rank 5, no thermals): 60.33,69.22 60.33,64.14 67.31,64.14 67.31,69.22
  pour Top (isolate 0.61, rank 5, no thermals): 40.64,54.61 40.64,49.53 47.62,49.53 47.62,54.61
  pour Top (isolate 0.61, rank 5, no thermals): 21.59,69.22 21.59,64.14 28.57,64.14 28.57,69.22
  pour Top (isolate 0.61, rank 5, no thermals): 40.64,38.73 40.64,33.66 47.62,33.66 47.62,38.73
IBUS0  (via drill 0.71)
  Top 0.305: IC9.18 116.84,62.87 121.92,57.78 132.72,57.78 133.35,57.15 IC7.2 133.35,53.34 135.25,51.44 v135.25,19.68
  Bottom 0.305: P1.1 119.38,5.08 120.65,6.35 121.92,6.35 123.83,8.26 IC5.18 123.83,15.88 124.46,16.51 132.72,16.51 135.25,19.05 v135.25,19.68
IBUS1  (via drill 0.71)
  Top 0.305: IC9.17 118.11,62.87 122.56,58.42 133.99,58.42 134.62,57.78 IC7.3 134.62,53.34 135.89,52.07 135.89,22.23 v136.53,21.59
  Bottom 0.305: P1.2 121.92,5.08 125.09,8.26 IC5.17 125.09,15.24 125.73,15.88 133.35,15.88 136.53,19.05 v136.53,21.59
IBUS2  (via drill 0.71)
  Top 0.305: IC9.16 119.38,62.87 123.19,59.05 134.62,59.05 135.89,57.78 IC7.4 135.89,53.34 136.53,52.7 136.53,23.5 137.79,22.23 v137.79,19.68
  Bottom 0.305: P1.3 124.46,6.35 126.36,8.26 IC5.16 126.36,14.61 127,15.24 133.99,15.24 137.79,19.05 v137.79,19.68
IBUS3  (via drill 0.71)
  Top 0.305: IC9.15 120.65,62.87 123.83,59.69 135.25,59.69 137.16,57.78 IC7.5 137.16,24.13 139.06,22.23 v139.06,21.59
  Bottom 0.305: P1.4 127,7.62 127.64,8.26 IC5.15 127.64,13.97 128.27,14.61 134.62,14.61 139.06,19.05 v139.06,21.59
IBUS4  (via drill 0.71)
  Top 0.305: IC9.14 121.92,62.87 124.46,60.33 135.89,60.33 138.43,57.78 IC7.6 138.43,53.34 137.79,52.7 137.79,24.77 140.34,22.23 v140.34,19.68
  Bottom 0.305: P1.5 129.54,7.62 128.91,8.26 IC5.14 128.91,13.34 129.54,13.97 135.25,13.97 140.34,19.05 v140.34,19.68
IBUS5  (via drill 0.71)
  Top 0.305: IC9.13 123.19,62.87 125.09,60.96 136.53,60.96 139.7,57.78 IC7.7 139.7,53.34 138.43,52.07 138.43,25.4 141.6,22.23 v141.6,21.59
  Bottom 0.305: P1.6 132.08,6.35 130.18,8.26 IC5.13 130.18,12.7 130.81,13.34 135.89,13.34 141.6,19.05 v141.6,21.59
IBUS6  (via drill 0.71)
  Top 0.305: IC9.12 124.46,62.87 125.73,61.59 137.16,61.59 140.97,57.78 IC7.8 140.97,53.34 139.06,51.44 139.06,26.04 142.88,22.23 v142.88,19.68
  Bottom 0.305: P1.7 134.62,5.08 131.44,8.26 IC5.12 131.44,12.06 132.08,12.7 136.53,12.7 142.88,19.05 v142.88,19.68
IBUS7  (via drill 0.71)
  Top 0.305: v144.15,21.59 144.15,22.23 139.7,26.67 139.7,50.8 142.24,53.34 IC7.9 142.24,57.78 137.79,62.23 126.36,62.23 125.73,62.87 IC9.11
  Bottom 0.305: P1.8 137.16,5.08 135.89,6.35 134.62,6.35 132.72,8.26 IC5.11 132.72,11.43 133.35,12.06 137.16,12.06 144.15,19.05 v144.15,21.59
IBUS8  (via drill 0.71)
  Top 0.305: IC10.18 99.06,63.5 98.42,62.87 82.55,62.87 80.01,60.33 IC8.2 80.01,20.95 81.28,19.68 83.19,19.68 v83.82,19.05
  Bottom 0.305: P2.1 93.98,5.08 95.25,6.35 96.52,6.35 98.42,8.26 IC6.18 98.42,11.43 97.79,12.06 88.9,12.06 83.82,17.14 v83.82,19.05
IBUS9  (via drill 0.71)
  Top 0.305: IC10.17 100.33,63.5 99.06,62.23 83.19,62.23 81.28,60.33 IC8.3 81.28,53.34 80.64,52.7 80.64,21.59 81.92,20.32 84.45,20.32 85.09,19.68 v85.09,17.78
  Bottom 0.305: P2.2 96.52,5.08 99.69,8.26 IC6.17 99.69,11.43 98.42,12.7 89.53,12.7 85.09,17.14 v85.09,17.78
IBUS10  (via drill 0.71)
  Top 0.305: IC10.16 101.6,63.5 99.69,61.59 83.82,61.59 82.55,60.33 IC8.4 82.55,53.34 81.28,52.07 81.28,22.23 82.55,20.95 85.09,20.95 86.36,19.68 v86.36,19.05
  Bottom 0.305: P2.3 99.06,6.35 100.97,8.26 IC6.16 100.97,11.43 99.06,13.34 90.17,13.34 86.36,17.14 v86.36,19.05
IBUS11  (via drill 0.71)
  Top 0.305: IC10.15 102.87,63.5 100.33,60.96 85.09,60.96 83.82,59.69 IC8.5 83.82,53.34 81.92,51.44 81.92,22.86 83.19,21.59 85.72,21.59 87.63,19.68 v87.63,17.78
  Bottom 0.305: P2.4 101.6,7.62 102.23,8.26 IC6.15 102.23,11.43 99.69,13.97 90.81,13.97 87.63,17.14 v87.63,17.78
IBUS12  (via drill 0.71)
  Top 0.305: IC10.14 104.14,63.5 100.97,60.33 85.72,60.33 85.09,59.69 IC8.6 85.09,53.34 82.55,50.8 82.55,23.5 83.82,22.23 86.36,22.23 88.9,19.68 v88.9,19.05
  Bottom 0.305: P2.5 104.14,7.62 103.5,8.26 IC6.14 103.5,11.43 100.33,14.61 91.44,14.61 88.9,17.14 v88.9,19.05
IBUS13  (via drill 0.71)
  Top 0.305: IC10.13 105.41,63.5 101.6,59.69 87,59.69 86.36,59.05 IC8.7 86.36,53.34 83.19,50.16 83.19,24.13 84.45,22.86 87,22.86 90.17,19.68 v90.17,17.78
  Bottom 0.305: P2.6 106.68,6.35 104.78,8.26 IC6.13 104.78,11.43 100.97,15.24 92.08,15.24 90.17,17.14 v90.17,17.78
IBUS14  (via drill 0.71)
  Top 0.305: v91.44,19.05 91.44,19.68 87.63,23.5 85.09,23.5 83.82,24.77 83.82,49.53 87.63,53.34 IC8.8 87.63,58.42 88.27,59.05 102.23,59.05 106.68,63.5 IC10.12 106.68,66.04
  Bottom 0.305: P2.7 109.22,5.08 106.05,8.26 IC6.12 106.05,11.43 101.6,15.88 92.71,15.88 91.44,17.14 v91.44,19.05
IBUS15  (via drill 0.71)
  Top 0.305: IC10.11 107.95,63.5 102.87,58.42 89.53,58.42 88.9,57.78 IC8.9 88.9,53.34 84.45,48.9 84.45,25.4 85.72,24.13 88.27,24.13 92.71,19.68 v92.71,17.78
  Bottom 0.305: P2.8 111.76,5.08 110.49,6.35 109.22,6.35 107.31,8.26 IC6.11 107.31,11.43 102.23,16.51 93.34,16.51 92.71,17.14 v92.71,17.78
N$1
  Bottom 0.305: SW1.1 RN1.2 113.67,25.4 116.84,22.23 121.92,22.23 122.56,21.59 IC5.2
N$2
  Bottom 0.305: SW1.2 RN1.3 116.2,25.4 118.75,22.86 123.19,22.86 123.83,22.23 IC5.3
N$3
  Bottom 0.305: SW1.3 RN1.4 118.75,25.4 120.65,23.5 124.46,23.5 125.09,22.86 IC5.4
N$4
  Bottom 0.305: SW1.4 RN1.5 121.28,25.4 122.56,24.13 125.09,24.13 126.36,22.86 IC5.5
N$5
  Bottom 0.305: SW1.5 RN1.6 123.83,25.4 124.46,24.77 125.73,24.77 127.64,22.86 IC5.6
N$6
  Bottom 0.305: SW1.6 RN1.7 126.36,25.4 128.91,22.86 IC5.7
N$7
  Bottom 0.305: SW1.7 RN1.8 128.91,25.4 130.18,24.13 IC5.8
N$8
  Bottom 0.305: SW1.8 RN1.9 IC5.9
N$9
  Bottom 0.305: SW2.1 RN2.2 88.27,25.4 89.53,24.13 92.71,24.13 94.61,22.23 96.52,22.23 97.16,21.59 IC6.2
N$10
  Bottom 0.305: SW2.2 RN2.3 90.81,25.4 91.44,24.77 93.34,24.77 95.25,22.86 97.79,22.86 98.42,22.23 IC6.3
N$11
  Bottom 0.305: SW2.3 RN2.4 93.34,26.04 95.89,23.5 99.06,23.5 99.69,22.86 IC6.4
N$12
  Bottom 0.305: SW2.4 RN2.5 95.89,25.4 97.16,24.13 99.69,24.13 100.97,22.86 IC6.5
N$13
  Bottom 0.305: SW2.5 RN2.6 98.42,25.4 99.06,24.77 100.33,24.77 102.23,22.86 IC6.6
N$14
  Bottom 0.305: SW2.6 RN2.7 100.97,25.4 103.5,22.86 IC6.7
N$15
  Bottom 0.305: SW2.7 RN2.8 103.5,25.4 104.78,24.13 IC6.8
N$16
  Bottom 0.305: SW2.8 RN2.9 IC6.9
N$22
  Top 0.305: RN3.2 IC9.2
  Bottom 0.305: CON3.1 RN3.2
N$31  (via drill 0.71)
  Top 0.305: v102.87,78.74 IC3.5 | v121.28,80.01 IC4.5 | v77.47,80.01 77.47,84.45 80.01,87 IC1.19
  Bottom 0.305: v121.28,80.01 120.65,79.38 103.5,79.38 v102.87,78.74 102.23,79.38 90.17,79.38 89.53,78.74 85.09,78.74 83.82,80.01 v77.47,80.01
N$32  (1 unrouted)
N$39
  Top 0.305: IC11.3 62.23,48.26 63.5,48.26 IC11.4
N$42  (1 unrouted)
N$43  (1 unrouted)
N$44  (via drill 0.71)
  Top 0.305: IC11.11 63.5,58.42 64.14,59.05 69.22,59.05 70.48,60.33 70.48,67.94 69.85,68.58 v69.85,82.55 | v62.23,87 IC12.14
  Bottom 0.305: v69.85,82.55 62.87,82.55 62.23,83.19 v62.23,87
N$45  (via drill 0.71)  (1 unrouted)
  Top 0.305: v24.77,45.72 IC15.4 | v40.01,30.48 41.27,31.75 IC13.2 | v40.01,75.56 IC14.1 | v66.04,75.56 IC12.6
  Bottom 0.305: v24.77,45.72 26.67,45.72 27.3,46.35 40.01,46.35 41.27,43.81 41.27,31.75 v40.01,30.48 | v40.01,75.56 41.27,74.3 64.77,74.3 v66.04,75.56
N$46  (via drill 0.71)  (2 unrouted)
  Top 0.305: v26.04,46.99 IC15.5 | v42.55,31.11 IC13.3
  Bottom 0.305: v26.04,46.99 40.64,46.99 42.55,43.81 v42.55,31.11
N$47
  Top 0.305: IC11.6 66.04,46.99 66.67,46.35 69.22,46.35 71.12,48.26 71.12,85.72 69.85,87 64.14,87 63.5,86.36 IC12.13
N$48  (1 unrouted)
N$49
  Top 0.305: CON1.1 124.46,71.75 126.36,69.85 130.18,69.85 131.44,68.58 132.72,68.58 133.35,67.94 IC7.19
N$50
  Top 0.305: CON1.2 127,71.75 128.27,70.48 130.81,70.48 132.08,69.22 133.99,69.22 134.62,68.58 IC7.18
N$51
  Top 0.305: CON1.3 129.54,71.75 130.18,71.12 131.44,71.12 132.72,69.85 135.25,69.85 135.89,69.22 IC7.17
N$52  (1 unrouted)
  Top 0.305: CON1.4 132.08,71.75 133.35,70.48 135.89,70.48 137.16,69.22 137.16,67.94 137.16,66.04
N$53
  Top 0.305: CON1.5 134.62,71.75 135.25,71.12 136.53,71.12 138.43,69.22 IC7.15
N$54
  Top 0.305: CON1.6 137.16,71.75 139.7,69.22 IC7.14
N$56
  Top 0.305: IC7.13 140.97,70.48 139.7,71.75 CON1.7
N$59
  Top 0.305: IC17.15 21.59,24.45 C26.1 R1.1
N$62
  Top 0.305: IC7.12 CON1.8
N$63
  Top 0.305: IC8.19 CON2.1
N$64
  Top 0.305: CON2.2 82.55,71.75 81.28,70.48 IC8.18
N$65
  Top 0.305: CON2.3 85.09,71.75 82.55,69.22 IC8.17
N$66
  Top 0.305: CON2.4 87.63,71.75 83.82,67.94 IC8.16
N$67
  Top 0.305: CON2.5 90.17,71.75 89.53,71.12 88.27,71.12 85.09,67.94 IC8.15
N$68
  Top 0.305: CON2.6 92.71,71.75 91.44,70.48 88.9,70.48 86.36,67.94 IC8.14
N$69
  Top 0.305: CON2.7 95.25,71.75 93.34,69.85 89.53,69.85 87.63,67.94 IC8.13
N$70
  Top 0.305: CON2.8 97.79,72.39 94.61,69.22 90.17,69.22 88.9,67.94 IC8.12
N$71
  Top 0.305: IC9.3 116.84,52.07 118.11,50.8 RN3.3
  Bottom 0.305: CON3.2 RN3.3
N$72
  Top 0.305: IC9.4 118.11,52.07 120.65,49.53 RN3.4
  Bottom 0.305: CON3.3 RN3.4
N$73
  Top 0.305: IC9.5 119.38,52.07 121.28,50.16 122.56,50.16 123.19,49.53 RN3.5
  Bottom 0.305: CON3.4 RN3.5
N$74
  Top 0.305: IC9.6 120.65,52.07 121.92,50.8 124.46,50.8 125.73,49.53 RN3.6
  Bottom 0.305: CON3.5 RN3.6
N$75
  Top 0.305: IC9.7 121.92,52.07 122.56,51.44 127,51.44 128.27,50.16 RN3.7
  Bottom 0.305: CON3.6 RN3.7
N$76
  Top 0.305: IC9.8 123.19,52.7 123.83,52.07 128.91,52.07 130.81,50.16 RN3.8
  Bottom 0.305: CON3.7 RN3.8
N$77  (1 unrouted)
N$78
  Top 0.305: IC9.9 124.46,53.34 125.09,52.7 130.81,52.7 133.35,50.16 RN3.9
  Bottom 0.305: CON3.8 RN3.9
N$79
  Top 0.305: IC17.7 27.94,10.47 C27.1 28.57,9.84 28.57,8.89 27.94,8.26 22.86,8.26 22.23,8.89 22.23,10.16 R2.1
N$80
  Top 0.305: IC18.15 40.64,24.45 C28.1 R3.1
N$81  (via drill 0.71)
  Top 0.305: R4.1 40.64,10.16 40.64,8.89 v41.27,8.26 | IC18.7 46.99,10.47 C29.1 47.62,9.84 47.62,8.89 v46.99,8.26
  Bottom 0.305: v41.27,8.26 v46.99,8.26
N$82  (1 unrouted)
  Top 0.305: IC16.13 22.23,70.48 23.5,70.48 IC16.12
N$83  (via drill 0.71)
  Top 0.305: v59.05,26.04 IC24.2 | v53.98,10.16 v53.98,24.77 | v62.23,10.16 IC20.3
  Bottom 0.305: v59.05,26.04 58.42,25.4 54.61,25.4 v53.98,24.77 | v53.98,10.16 v62.23,10.16
N$84
  Top 0.305: IC10.2 97.79,53.34 97.16,52.7 92.08,52.7 88.9,49.53 RN4.2
  Bottom 0.305: CON4.1 RN4.2
N$85
  Top 0.305: IC10.3 99.06,52.7 98.42,52.07 93.98,52.07 91.44,49.53 RN4.3
  Bottom 0.305: CON4.2 RN4.3
N$86
  Top 0.305: IC10.4 100.33,52.07 99.69,51.44 95.89,51.44 93.98,49.53 RN4.4
  Bottom 0.305: CON4.3 RN4.4
N$87
  Top 0.305: IC10.5 101.6,52.07 100.33,50.8 97.79,50.8 96.52,49.53 RN4.5
  Bottom 0.305: CON4.4 RN4.5
N$88
  Top 0.305: IC10.6 102.87,52.07 102.23,51.44 100.97,50.16 99.69,50.16 99.06,49.53 RN4.6
  Bottom 0.305: CON4.5 RN4.6
N$89
  Top 0.305: IC10.7 104.14,52.07 101.6,49.53 RN4.7
  Bottom 0.305: CON4.6 RN4.7
N$90  (1 unrouted)
  Top 0.305: IC10.8 105.41,52.07 104.14,50.8 104.14,47.62
  Bottom 0.305: CON4.7 RN4.8
N$91
  Top 0.305: RN4.9 IC10.9
  Bottom 0.305: CON4.8 RN4.9
N$102  (via drill 0.71)
  Top 0.305: IC23.5 45.09,62.23 v46.35,60.96 | v72.39,64.77 71.75,64.14 71.75,27.3 67.31,22.86 IC20.8
  Bottom 0.305: v72.39,64.77 71.75,65.41 46.99,65.41 46.35,64.77 v46.35,60.96
N$316
  Top 0.305: IC20.11 63.5,22.86 62.87,23.5 62.87,26.04 61.59,27.3 IC24.4
N$317  (1 unrouted)
N$318  (via drill 0.71)
  Top 0.305: IC20.6 66.04,12.7 67.31,11.43 69.22,11.43 70.48,12.7 v70.48,16.51 | v64.14,24.13 IC24.6
  Bottom 0.305: v64.14,24.13 66.04,22.23 68.58,22.23 70.48,20.32 v70.48,16.51
N$319  (1 unrouted)
N$321  (1 unrouted)
POWEROK  (1 unrouted)
RUN  (1 unrouted)
  Bottom 0.305: CON5.7 15.88,39.37
STOP  (via drill 0.71)
  Top 0.305: v20.95,45.72 22.86,45.72 23.5,46.35 IC15.3
  Bottom 0.305: CON5.8 3.81,36.2 20.32,36.2 21.59,37.47 21.59,45.09 v20.95,45.72
VCC  (via drill 0.71)  (3 unrouted)
  Top 0.305: IC17.3 22.86,13.97 | IC18.11 45.85,20.98
  Bottom 0.305: v112.39,64.77 114.17,64.77 | v94.61,64.77 C16.2 | C21.2 v76.2,64.77 | C8.2 v114.3,90.81 | v118.75,9.53 121.23,9.53 IC5.20 | v130.18,64.77 C7.2 | v93.98,9.53 95.83,9.53 IC6.20 | 78.74,92.08 C15.2 78.74,92.39 v78.74,94.61 | C10.2 19.9,20.95 v18.41,20.95 | C19.2 38.95,20.95 v37.47,20.95 | C4.2 v38.73,85.09 | v55.24,41.27 C9.2 | v19.05,84.45 C23.2 | v37.47,69.85 C18.2 | v18.41,55.24 C17.2 | v57.15,55.24 C13.2 | v57.15,69.85 C14.2 | v57.15,20.95 C20.2 | 114.17,64.77 114.17,64.86 | 114.17,64.77 C3.2 | C5.2 arc-90 97.79,91.22 v97.79,93.34 | v37.47,55.24 C24.2 | v56.52,84.45 C6.2 | C12.2 38.73,39.37 39.37,40.01 v39.37,41.27 | C22.2 20.32,39.69 v20.32,41.27
  Bottom 1.27: v78.74,26.67 RN2.1
  other vias: 18.41,69.85
  pour Top (isolate 0.61, rank 6, no thermals): 0,0 160.02,0 160.02,99.06 0,99.06

## Text on the board
tNames: !WIR | !WIO | !WMEM | !RMEM | !RIO | Output Reg HI | Output Reg LO | !WAC | !WADDR | http://www.bedroomlan.org/cft | !RUN | Switch Reg HI | Switch Reg LO | !STOP | FETCH | !STEP | !++ADDR | «!SWNHBT | «RUN | «STOP | CFT Front Panel Controller Rev A | (c) 2011 AlexiosC